# EAGLE design Adafruit Eyes Bonnet (EAGLE 6.4)
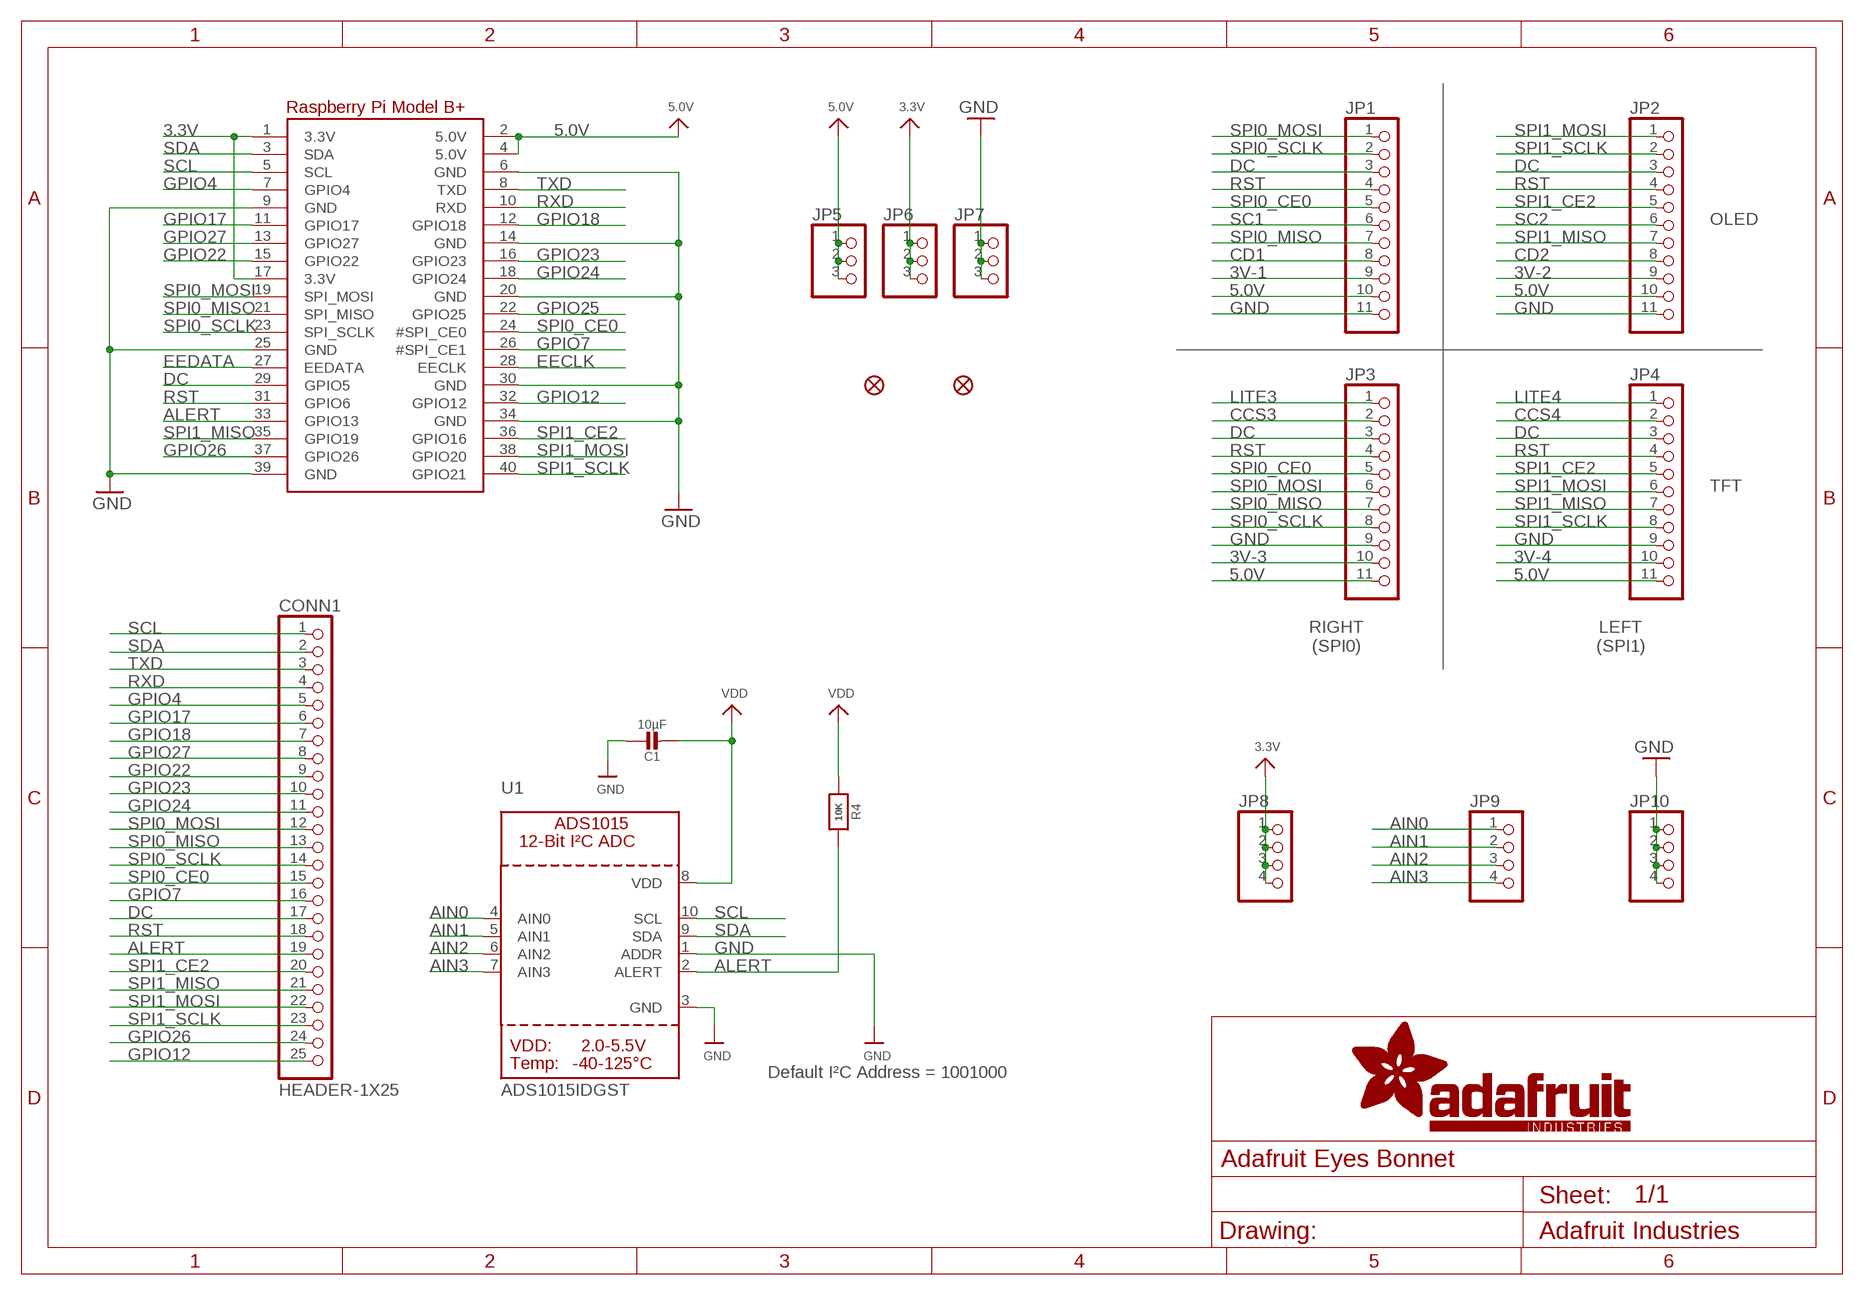
[diagram p0: schematic, sheet 1]

## Parts
C1  10µF  CAP_CERAMIC0805-NOOUTLINE  [0805-NO]
CONN1  HEADER-1X25  [1X25_ROUND_70MIL]
FID1  FIDUCIAL""  [FIDUCIAL_1MM]
FID2  FIDUCIAL""  [FIDUCIAL_1MM]
JP1  HEADER-1X11  [1X11_ROUND]
JP2  HEADER-1X11  [1X11_ROUND]
JP3  HEADER-1X11  [1X11_ROUND]
JP4  HEADER-1X11  [1X11_ROUND]
JP5  HEADER-1X376MIL  [1X03_ROUND_76]
JP6  HEADER-1X376MIL  [1X03_ROUND_76]
JP7  HEADER-1X376MIL  [1X03_ROUND_76]
JP8  HEADER-1X4ROUND  [1X04_ROUND]
JP9  HEADER-1X4ROUND  [1X04_ROUND]
JP10  HEADER-1X4ROUND  [1X04_ROUND]
R4  10K  RESISTOR0805_NOOUTLINE  [0805-NO]
RPI1  RASPBERRYPI_BPLUS_PHAT  [PI_BONNET]
U1  ADS1015IDGST  ADC_ADS1015  [MSOP10]

## Nets
3.3V: C1.2 JP6.1 JP6.2 JP6.3 JP8.1 JP8.2 JP8.3 JP8.4 R4.1 RPI1.1(3.3V) RPI1.17(3.3V) U1.8(VDD) ; supply symbol labelled VDD
3V-1: JP1.9
3V-2: JP2.9
3V-3: JP3.10
3V-4: JP4.10
5.0V: JP1.10 JP2.10 JP3.11 JP4.11 JP5.1 JP5.2 JP5.3 RPI1.2(5.0V) RPI1.4(5.0V)
AIN0: JP9.1 U1.4(AIN0)
AIN1: JP9.2 U1.5(AIN1)
AIN2: JP9.3 U1.6(AIN2)
AIN3: JP9.4 U1.7(AIN3)
ALERT: CONN1.19 R4.2 RPI1.33(GPIO13) U1.2(ALERT)
CCS3: JP3.2
CCS4: JP4.2
CD1: JP1.8
CD2: JP2.8
DC: CONN1.17 JP1.3 JP2.3 JP3.3 JP4.3 RPI1.29(GPIO5)
EECLK: RPI1.28(EECLK)
EEDATA: RPI1.27(EEDATA)
GND: C1.1 JP1.11 JP2.11 JP3.9 JP4.9 JP7.1 JP7.2 JP7.3 JP10.1 JP10.2 JP10.3 JP10.4 RPI1.6(GND) RPI1.9(GND) RPI1.14(GND) RPI1.20(GND) RPI1.25(GND) RPI1.30(GND) RPI1.34(GND) RPI1.39(GND) U1.1(ADDR) U1.3(GND)
GPIO4: CONN1.5 RPI1.7(GPIO4)
GPIO7: CONN1.16 RPI1.26(#SPI_CE1)
GPIO12: CONN1.25 RPI1.32(GPIO12)
GPIO17: CONN1.6 RPI1.11(GPIO17)
GPIO18: CONN1.7 RPI1.12(GPIO18)
GPIO22: CONN1.9 RPI1.15(GPIO22)
GPIO23: CONN1.10 RPI1.16(GPIO23)
GPIO24: CONN1.11 RPI1.18(GPIO24)
GPIO25: RPI1.22(GPIO25)
GPIO26: CONN1.24 RPI1.37(GPIO26)
GPIO27: CONN1.8 RPI1.13(GPIO27)
LITE3: JP3.1
LITE4: JP4.1
RST: CONN1.18 JP1.4 JP2.4 JP3.4 JP4.4 RPI1.31(GPIO6)
RXD: CONN1.4 RPI1.10(RXD)
SC1: JP1.6
SC2: JP2.6
SCL: CONN1.1 RPI1.5(SCL) U1.10(SCL)
SDA: CONN1.2 RPI1.3(SDA) U1.9(SDA)
SPI0_CE0: CONN1.15 JP1.5 JP3.5 RPI1.24(#SPI_CE0)
SPI0_MISO: CONN1.13 JP1.7 JP3.7 RPI1.21(SPI_MISO)
SPI0_MOSI: CONN1.12 JP1.1 JP3.6 RPI1.19(SPI_MOSI)
SPI0_SCLK: CONN1.14 JP1.2 JP3.8 RPI1.23(SPI_SCLK)
SPI1_CE2: CONN1.20 JP2.5 JP4.5 RPI1.36(GPIO16)
SPI1_MISO: CONN1.21 JP2.7 JP4.7 RPI1.35(GPIO19)
SPI1_MOSI: CONN1.22 JP2.1 JP4.6 RPI1.38(GPIO20)
SPI1_SCLK: CONN1.23 JP2.2 JP4.8 RPI1.40(GPIO21)
TXD: CONN1.3 RPI1.8(TXD)

## Notes on the sheet
- OLED
- TFT
- RIGHT
  (SPI0)
- LEFT
  (SPI1)
- Default I²C Address = 1001000

## Library data of the parts
C1 = microbuilder:CAP_CERAMIC: Ceramic Capacitors For new designs, use the packages preceded by an '_' character since they are more reliable: The following footprints should be used on most boards: _0402 - Standard footprint for regular board layouts _0603 - Standard footprint for regular board layouts _0805 - Standard footprint for regular board layouts _1206 - Standard footprint for regular board layouts For extremely tight-pitch boards where space is at a premium, the following 'micro-pitch' footprints can be used (smaller pads, no silkscreen outline, etc.): _0402MP - Micro-pitch footprint for very dense/compact boards _0603MP - Micro-pitch footprint for very dense/compact boards _0805MP - Micro-pitch footprint for very dense/compact boards _1206MP - Micro-pitch footprint for very dense/compact boards
CONN1 = microbuilder:HEADER-1X25
FID1 FID2 = microbuilder:FIDUCIAL: Fiducial Alignment Points Various fiducial points for machine vision alignment.; BOM: EXCLUDE
JP1-JP4 = microbuilder:HEADER-1X11
JP5-JP7 = microbuilder:HEADER-1X3: PIN HEADER
JP8-JP10 = microbuilder:HEADER-1X4: PIN HEADER
R4 = microbuilder:RESISTOR: Resistors For new designs, use the packages preceded by an '_' character since they are more reliable: The following footprints should be used on most boards: _0402 - Standard footprint for regular board layouts _0603 - Standard footprint for regular board layouts _0805 - Standard footprint for regular board layouts _1206 - Standard footprint for regular board layouts For extremely tight-pitch boards where space is at a premium, the following 'micro-pitch' footprints can be used (smaller pads, no silkscreen outline, etc.): _0402MP - Micro-pitch footprint for very dense/compact boards _0603MP - Micro-pitch footprint for very dense/compact boards _0805MP - Micro-pitch footprint for very dense/compact boards _1206MP - Micro-pitch footprint for very dense/compact boards
RPI1 = microbuilder:RASPBERRYPI_BPLUS
U1 = microbuilder:ADC_ADS1015: ADS1015 - 12-bit 4-Channel I2C ADC with Internal PGA VDD: 2.0-5.5V Sampling Rate: 3.3ksps Gain Settings: 2/3, 1, 2, 4, 8, 16 I2C Address: ADDR low = 1001000x, ADDR high = 1001001x Internal Comparator The ADS1015 includes an internal comparator that can be set to output a high-level on ALERT when the conversion results exceeeds a pre-defined upper level, and will deassert itself when the level falls below a pre-defined lower threshold level. It can also be set to windowed mode where the ALERT pin will be asserted if the data exceeds the upper threshold or falls below the lower threshold.

## Board
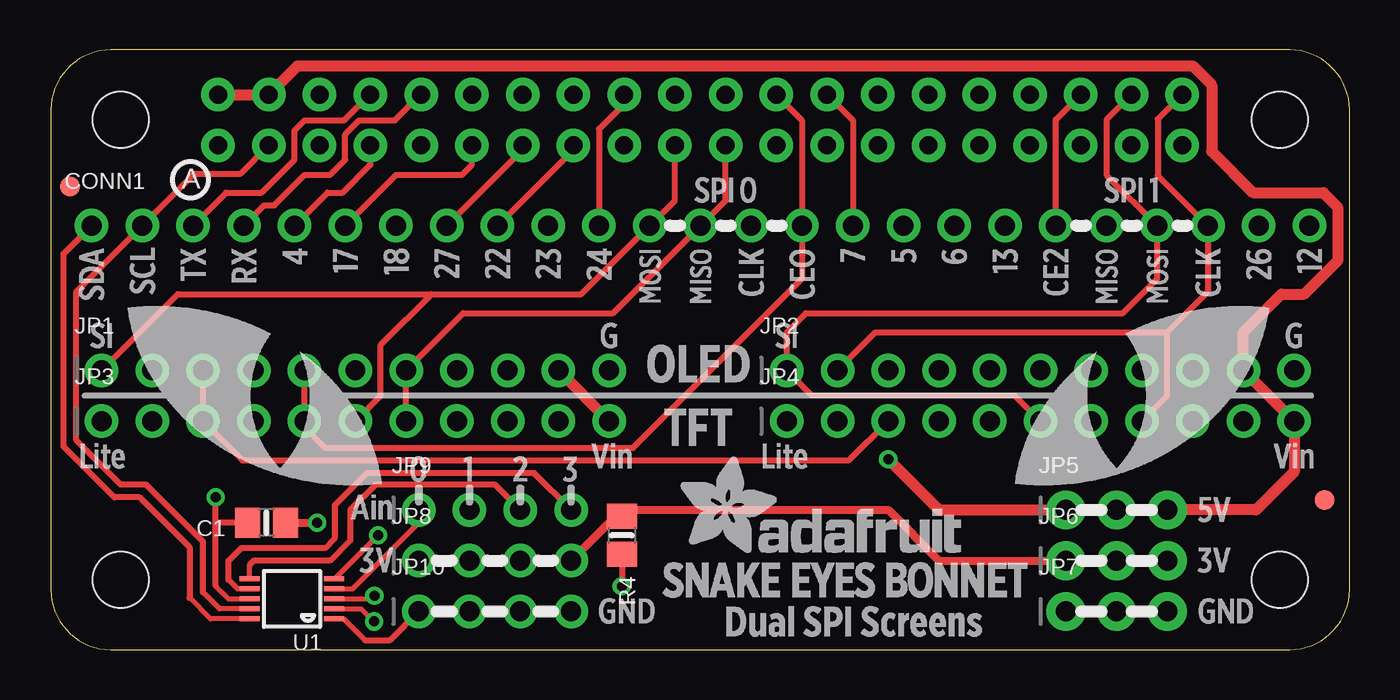
[diagram p1: board, top side]
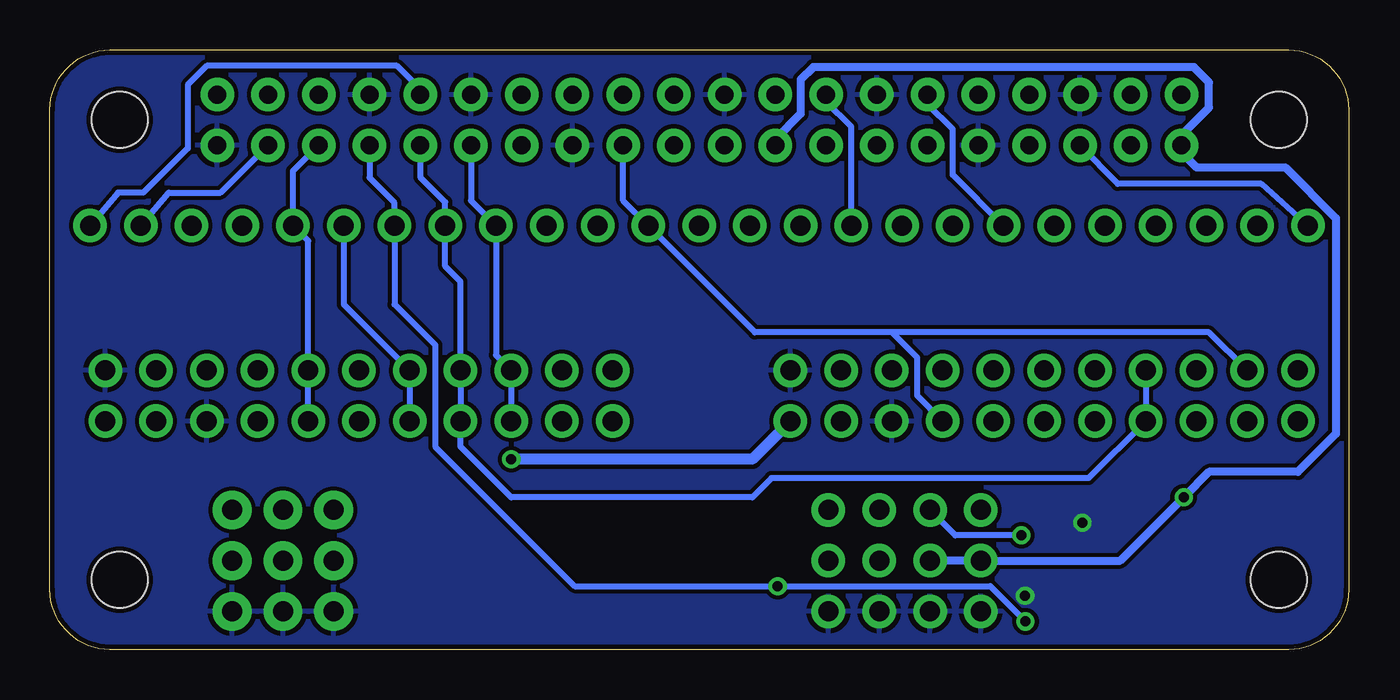
[diagram p2: board, bottom side, seen from below]

Size 65 x 30 mm. Coordinates in mm from the lower left corner, seen from the top.
Copper layers (1*16): Top 0.035mm / dielectric 1.5mm / Bottom 0.035mm
Design rules "adafruit": minimum track width 8mil, minimum drill 15.5mil, track to track 8mil, track to pad 8mil, pad to pad 8mil, via to via 8mil, smd to smd 8mil, copper to edge 10mil, drill to drill 8mil, minimum pad ring 10mil, minimum via ring 8mil, stop-mask expansion 2mil, vias tented up to drill 20mil, thermal gap 10mil

### Footprints (pad centres in the part's own frame; a part is rotated, then mirrored left to right if it is on the bottom)
0805-NO = smd 1.24 x 1.5: 1 -0.95,0; 2 0.95,0
1X25_ROUND_70MIL = drill 1 pad 1.676: 1 -30.48,0; 2 -27.94,0; 3 -25.4,0; 4 -22.86,0; 5 -20.32,0; 6 -17.78,0; 7 -15.24,0; 8 -12.7,0; 9 -10.16,0; 10 -7.62,0; 11 -5.08,0; 12 -2.54,0; 13 0,0; 14 2.54,0; 15 5.08,0; 16 7.62,0; 17 10.16,0; 18 12.7,0; 19 15.24,0; 20 17.78,0; 21 20.32,0; 22 22.86,0; 23 25.4,0; 24 27.94,0; 25 30.48,0
FIDUCIAL_1MM = smd 1 x 1: 1 0,0
1X11_ROUND = drill 1 pad 1.676: 1 -12.7,0; 2 -10.16,0; 3 -7.62,0; 4 -5.08,0; 5 -2.54,0; 6 0,0; 7 2.54,0; 8 5.08,0; 9 7.62,0; 10 10.16,0; 11 12.7,0
1X03_ROUND_76 = drill 1 pad 1.93: 1 -2.54,0; 2 0,0; 3 2.54,0
1X04_ROUND = drill 1 pad 1.676: 1 -3.81,0; 2 -1.27,0; 3 1.27,0; 4 3.81,0
PI_BONNET = drill 0.9 pad 1.676: 1 8.37,25.23; 2 8.37,27.77; 3 10.91,25.23; 4 10.91,27.77; 5 13.45,25.23; 6 13.45,27.77; 7 15.99,25.23; 8 15.99,27.77; 9 18.53,25.23; 10 18.53,27.77; 11 21.07,25.23; 12 21.07,27.77; 13 23.61,25.23; 14 23.61,27.77; 15 26.15,25.23; 16 26.15,27.77; 17 28.69,25.23; 18 28.69,27.77; 19 31.23,25.23; 20 31.23,27.77; 21 33.77,25.23; 22 33.77,27.77; 23 36.31,25.23; 24 36.31,27.77; 25 38.85,25.23; 26 38.85,27.77; 27 41.39,25.23; 28 41.39,27.77; 29 43.93,25.23; 30 43.93,27.77; 31 46.47,25.23; 32 46.47,27.77; 33 49.01,25.23; 34 49.01,27.77; 35 51.55,25.23; 36 51.55,27.77; 37 54.09,25.23; 38 54.09,27.77; 39 56.63,25.23; 40 56.63,27.77 | hole 2.8: 3.5,3.5; 3.5,26.5; 61.5,26.5; 61.5,3.5
MSOP10 = smd 0.25 x 1: 1 -1,-2.113; 2 -0.5,-2.113; 3 0,-2.113; 4 0.5,-2.113; 5 1,-2.113; 6 1,2.113; 7 0.5,2.113; 8 0,2.113; 9 -0.5,2.113; 10 -1,2.113

### Placement (x,y rotation side)
C1  10.79,6.35 180 top
CONN1  32.51,21.21 0 top
FID1  0.95,23.18 0 top
FID2  63.75,7.49 0 top
JP1  15.24,13.97 0 top
JP2  49.53,13.97 0 top
JP3  15.24,11.43 0 top
JP4  49.53,11.43 0 top
JP5  53.34,6.99 0 top
JP6  53.34,4.45 0 top
JP7  53.34,1.91 0 top
JP8  22.23,4.45 0 top
JP9  22.23,6.99 0 top
JP10  22.23,1.91 0 top
R4  28.57,5.71 270 top
RPI1  0,0 0 top
U1  12.06,2.54 90 top
U$8  [BONNET_EYES_REVA]  0,0 0 top

### Tracks (layer width: path | path; a pad name or v marks a point on that pad's centre or on a via)
3.3V  (via drill 0.5)
  Top 0.254: 8.26,3.17 8.89,2.54 U1.8
  Top 0.305: 8.26,3.17 8.26,6.35 | 8.26,6.35 v8.26,7.62 | C1.2 8.26,6.35
  Top 0.406: JP6.3 JP6.2 JP6.1 44.45,4.45 41.91,6.99 28.57,6.99 | JP8.1 JP8.3 JP8.4 28.57,6.99 | R4.1 28.57,6.99 | C1.2 10.16,6.35
  Bottom 0.406: RPI1.17 28.69,25.54 27.43,26.8 27.43,28.51 26.8,29.15 7.75,29.15 6.99,28.38 6.99,27.11 8.37,25.73 RPI1.1 8.37,24.88 7.62,24.13 3.17,24.13 0.64,21.59 0.64,10.79 2.54,8.89 6.99,8.89 v8.26,7.62 11.43,4.45 JP8.1 JP8.2
5.0V  (via drill 0.5)
  Top 0.559: JP1.10 JP3.11 | RPI1.2 RPI1.4 12.35,29.21 57.15,29.21 58.1,28.26 58.1,24.92 60.17,22.86 63.69,22.86 64.41,22.14 64.41,19.45 62.74,17.78 61.59,17.78 59.69,15.88 JP2.10 JP4.11 62.23,8.89 60.33,6.99 JP5.3 JP5.2 JP5.1 44.45,6.99 v41.91,9.53
  Bottom 0.559: JP3.11 29.84,9.53 v41.91,9.53
AIN0
  Top 0.254: U1.4 15.11,3.04 18.41,6.35
  Top 0.305: JP9.1 18.41,6.35
AIN1  (via drill 0.5)
  Top 0.254: U1.5 14.21,3.54 v16.38,5.71
  Bottom 0.305: v16.38,5.71 19.68,5.71 JP9.2
AIN2
  Top 0.254: U1.6 9.95,4.24
  Top 0.305: JP9.3 22.23,8.26 16.26,8.26 14.99,6.99 14.99,5.46 13.97,4.45 10.16,4.45 9.95,4.24
AIN3
  Top 0.254: U1.7 9.34,3.04 8.89,3.49
  Top 0.305: 8.89,3.49 8.89,4.45 9.53,5.08 13.72,5.08 14.22,5.59 14.22,7.24 15.81,8.83 24.19,8.83 JP9.4
ALERT  (via drill 0.5)
  Top 0.254: U1.2 15.53,2.04 v16.17,1.41
  Top 0.305: R4.2 v28.57,3.17
  Bottom 0.305: v16.17,1.41 17.94,3.17 v28.57,3.17 38.73,3.17 45.72,10.16 45.72,15.24 47.75,17.27 CONN1.19 47.75,22.35 49.01,23.61 RPI1.33
DC
  Top 0.305: JP4.3 39.94,9.46 9.59,9.46 JP3.3 JP1.3
  Bottom 0.305: JP4.3 JP2.3 42.67,14.73 CONN1.17 43.93,22.47 RPI1.29
GND  (via drill 0.5)
  Top 0.254: U1.1 14.65,1.54 15.72,0.48 | U1.3 16.03,2.54
  Top 0.305: 15.72,0.48 16.99,0.48 JP10.1 | 16.03,2.54 v16.19,2.7
  Top 0.406: C1.1 v13.34,6.35
  pour Bottom: 0,30.23 0,0 65.02,-0.13 65.02,30.1
  pour Bottom: 0,30.23 0,0 65.02,-0.13 65.02,30.1
GPIO4
  Top 0.305: CONN1.5 13.84,22.86 14.61,22.86 15.99,24.25 RPI1.7
GPIO7
  Top 0.305: RPI1.26 40.13,26.49 CONN1.16
GPIO12
  Bottom 0.305: RPI1.32 46.47,28.05 47.62,29.21 57.15,29.21 58.1,28.26 58.1,25.08 60.33,22.86 61.59,22.86 CONN1.25
GPIO17
  Top 0.305: CONN1.6 17.27,23.75 20.57,23.75 21.07,24.25 RPI1.11
GPIO18
  Bottom 0.305: CONN1.7 19.81,23.75 19.81,26.04 21.07,27.29 RPI1.12
GPIO22
  Top 0.305: CONN1.9 26.15,25.01 RPI1.15
GPIO23
  Bottom 0.305: CONN1.10 24.89,26.16 26.15,27.42 RPI1.16
GPIO24
  Top 0.305: RPI1.18 28.69,27.29 27.43,26.04 CONN1.11
GPIO26
  Bottom 0.305: CONN1.24 59.05,22.86 56.46,22.86 RPI1.37
GPIO27
  Top 0.305: CONN1.8 23.61,25.01 RPI1.13
RST
  Bottom 0.305: RPI1.31 46.47,23.64 45.21,22.38 CONN1.18 45.21,19.18 44.45,18.41 JP2.4 JP4.4 44.45,10.16 41.91,7.62 29.84,7.62 28.89,8.57 13.02,8.57 JP3.4 JP1.4
RXD
  Top 0.305: CONN1.4 10.67,22.23 11.18,22.23 12.7,23.75 13.97,23.75 14.73,24.51 14.73,25.78 15.43,26.48 17.21,26.48 18.46,27.73 RPI1.10
SCL
  Top 0.254: 6.94,2.59 7.99,1.54 U1.10
  Top 0.305: CONN1.1 0.64,19.81 0.64,10.16 3.17,7.62 4.45,7.62 6.94,5.13 6.94,2.59
  Bottom 0.305: RPI1.5 11.56,23.3 4.38,23.3 CONN1.1
SDA
  Top 0.254: U1.9 8.44,2.04 7.62,2.86
  Top 0.305: RPI1.3 9.49,23.81 7.18,23.81 CONN1.2 1.27,17.91 1.27,10.48 3.49,8.26 4.76,8.26 7.62,5.4 7.62,2.86
SPI0_CE0
  Top 0.305: JP1.5 JP3.5 12.7,11.11 13.72,10.1 29.15,10.1 37.59,18.54 CONN1.15 37.59,26.49 RPI1.24
SPI0_MISO
  Top 0.305: RPI1.21 33.77,22.47 CONN1.13 28.13,16.83 20.64,16.83 JP1.7 JP3.7
SPI0_MOSI
  Top 0.305: RPI1.19 31.23,22.47 CONN1.12 26.54,17.78 19.05,17.78 | JP1.1 6.35,17.78 19.05,17.78 | JP3.6 16.51,12.7 16.51,15.24 19.05,17.78
SPI0_SCLK
  Bottom 0.305: RPI1.23 36.31,22.47 CONN1.14 29.72,15.88 22.86,15.88 | JP1.2 6.99,15.88 22.86,15.88 | JP3.8 21.59,12.7 21.59,14.61 22.86,15.88
SPI1_CE2
  Top 0.305: CONN1.20 50.29,26.51 RPI1.36
  Bottom 0.305: JP4.5 JP2.5 50.29,17.27 CONN1.20
SPI1_MISO
  Bottom 0.305: JP4.7 JP2.7 52.07,20.45 CONN1.21 52.83,23.95 RPI1.35
SPI1_MOSI
  Top 0.305: JP4.6 48.26,12.7 38.1,12.7 JP2.1 36.83,15.88 37.78,16.83 53.66,16.83 55.37,18.54 CONN1.22 52.86,23.72 52.86,26.54 RPI1.38
SPI1_SCLK
  Top 0.305: JP2.2 41.27,15.88 55.88,15.88 | JP4.8 55.88,12.7 55.88,15.88 | 55.88,15.88 57.91,17.91 CONN1.23 55.4,23.72 55.4,26.54 RPI1.40
TXD
  Top 0.305: CONN1.3 8.76,22.86 10.54,22.86 12.19,24.51 12.19,25.97 12.7,26.48 14.67,26.48 15.92,27.73 RPI1.8

### Text on the board
tPlace: A